# EasyEDA Pro project AmpBoard64SMD.eprj, board Mod16Top_1
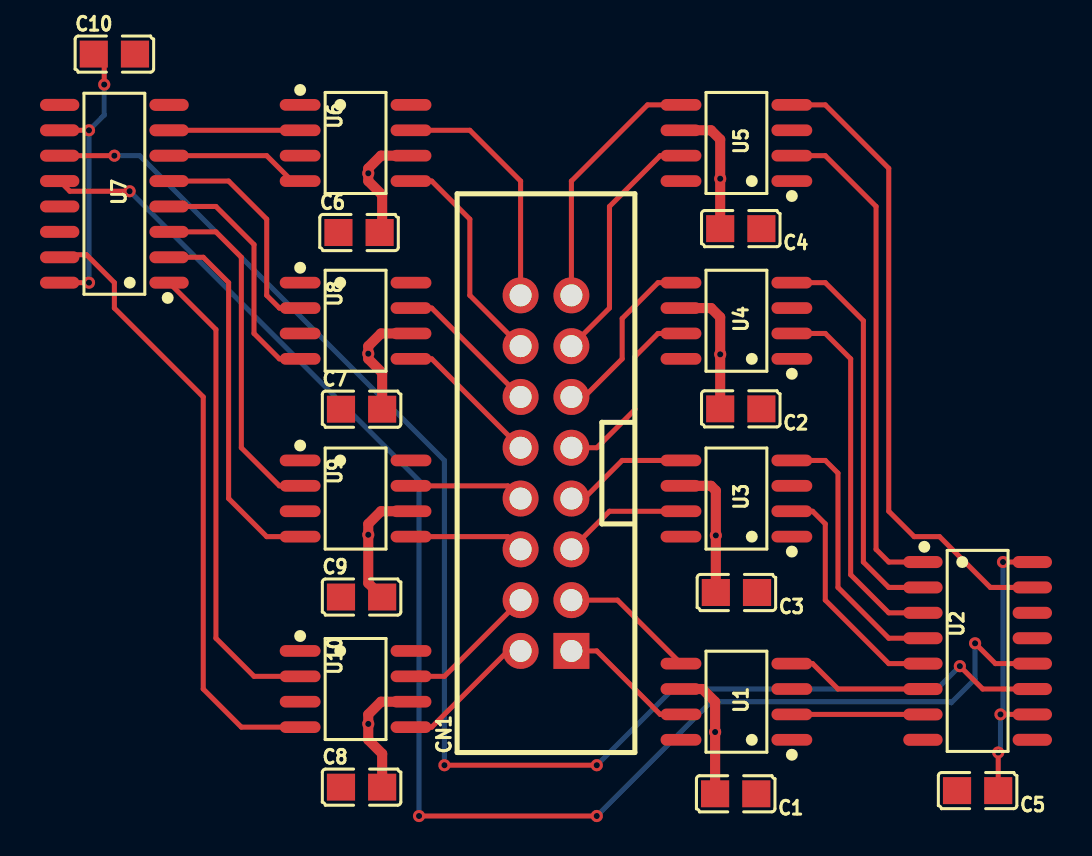
[diagram p7: board, top side]
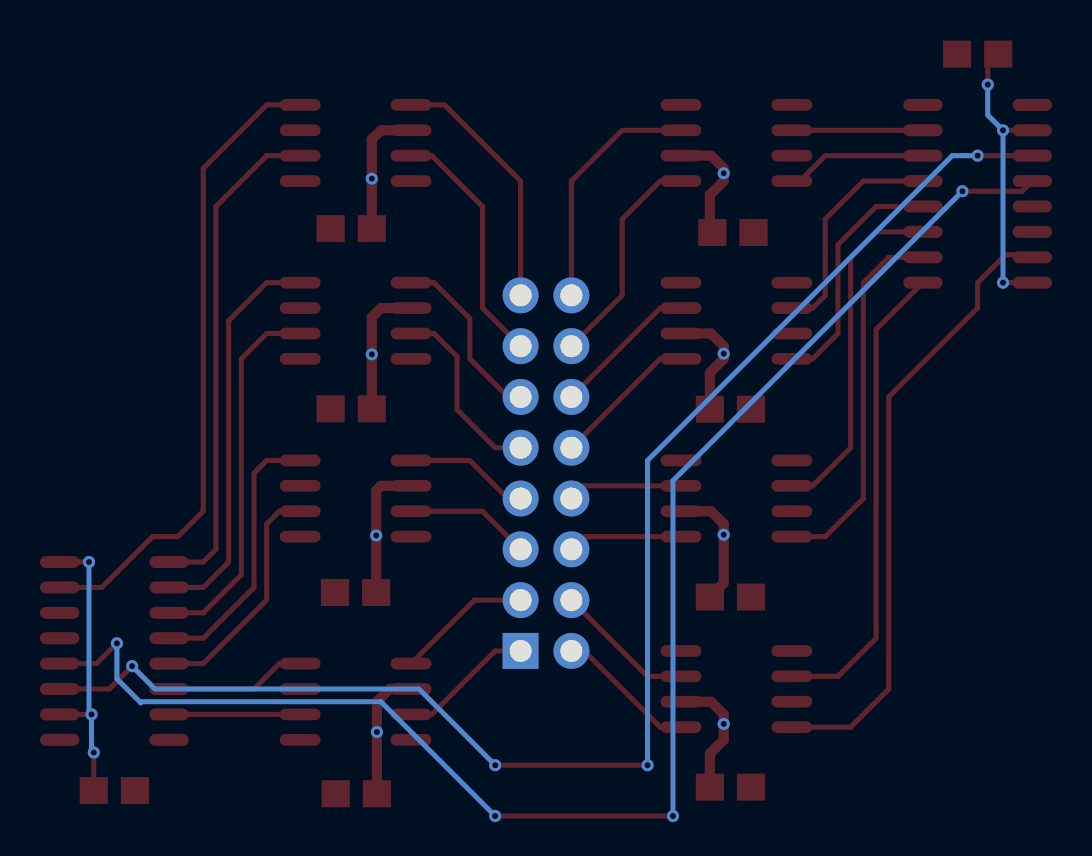
[diagram p8: board, bottom side, seen from below]

No outline. copper layers: Top Layer, Inner1, Inner2, Bottom Layer. Coordinates in mm from the lowest, leftmost part position.
Stack: Top Layer 0.035mm 外层铜厚1oz / Dielectric1 0.2104mm 7628 RC49% 8.6mil / Inner1 0.0152mm 内层铜厚 / Dielectric2 1.065mm 1.1mm H/HOZ 含铜 / Inner2 0.0152mm 内层铜厚 / Dielectric3 0.2104mm 7628 RC49% 8.6mil / Bottom Layer 0.035mm 外层铜厚1oz

## Design rules (mm)
template: JLCPCB Capability(Two Layers Board)
spacing copperThickness1oz (default): track to track 0.102, other pairs 0.152 to 0.3
spacing copperThickness2oz: track to track 0.203, other pairs 0.152 to 0.3
track width copperThickness1oz (default): min 0.127, default 0.254, max 2.54
track width copperThickness2oz: min 0.203, default 0.254, max 2.54
differential pair differentialPair (default): width min 0.127, default 0.254, max 2.54; gap min 0.152, default 0.152
via viaSize (default): diameter min 0.5, default 0.61, max 10; hole min 0.3, default 0.305, max 6.3

## Placement (name value [footprint] x y rotation side)
C1  100pF  [C0805]  31.08 0 180 top
C2  100pF  [C0805]  31.33 19.25 180 top
C3  100pF  [C0805]  31.12 10.07 180 top
C4  100pF  [C0805]  31.33 28.26 180 top
C5  100pF  [C0805]  43.18 0.16 180 top
C6  100pF  [C0805]  12.24 28.07 0 top
C7  100pF  [C0805]  12.37 19.23 0 top
C8  100pF  [C0805]  12.37 0.33 0 top
C9  100pF  [C0805]  12.37 9.84 0 top
C10  100pF  [C0805]  0 36.99 0 top
CN1  KH-2.54PH180-2X8P-L8.9  [CONN-TH_16P-P2.54_KINGHELM_KH-2.54PH180-2X8P-L8.9]  21.59 16.03 90 top
U1  IXDN602SIATR  [SOIC-8_L4.9-W3.9-P1.27-LS6.0-BL]  31.12 4.6 90 top
U2  74HC595D,118  [SOIC-16_L9.9-W3.9-P1.27-LS6.0-BL]  43.18 7.14 270 top
U3  IXDN602SIATR  [SOIC-8_L4.9-W3.9-P1.27-LS6.0-BL]  31.12 14.76 90 top
U4  IXDN602SIATR  [SOIC-8_L4.9-W3.9-P1.27-LS6.0-BL]  31.12 23.65 90 top
U5  IXDN602SIATR  [SOIC-8_L4.9-W3.9-P1.27-LS6.0-BL]  31.12 32.54 90 top
U6  IXDN602SIATR  [SOIC-8_L4.9-W3.9-P1.27-LS6.0-BL]  12.07 32.54 270 top
U7  74HC595D,118  [SOIC-16_L9.9-W3.9-P1.27-LS6.0-BL]  0 30 90 top
U8  IXDN602SIATR  [SOIC-8_L4.9-W3.9-P1.27-LS6.0-BL]  12.07 23.65 270 top
U9  IXDN602SIATR  [SOIC-8_L4.9-W3.9-P1.27-LS6.0-BL]  12.07 14.76 270 top
U10  IXDN602SIATR  [SOIC-8_L4.9-W3.9-P1.27-LS6.0-BL]  12.07 5.24 270 top

## Footprints (pads in the part's own frame, mm; a bottom-side part is the same pattern mirrored in y, then rotated)
C0805
  rect 1.41x1.35 smd: 1(-1.03,0) 2(1.03,0)
CONN-TH_16P-P2.54_KINGHELM_KH-2.54PH180-2X8P-L8.9
  rect 1.8x1.8 hole 1.1: 1(-8.89,-1.27)
  round 1.8 hole 1.1: 2(-8.89,1.27) 3(-6.35,-1.27) 4(-6.35,1.27) 5(-3.81,-1.27) 6(-3.81,1.27) 7(-1.27,-1.27) 8(-1.27,1.27) 9(1.27,-1.27) 10(1.27,1.27) 11(3.81,-1.27) 12(3.81,1.27) 13(6.35,-1.27) 14(6.35,1.27) 15(8.89,-1.27) 16(8.89,1.27)
SOIC-8_L4.9-W3.9-P1.27-LS6.0-BL
  oval 0.588x2.045 smd: 1(-1.905,-2.772) 2(-0.635,-2.772) 3(0.635,-2.772) 4(1.905,-2.772) 5(1.905,2.772) 6(0.635,2.772) 7(-0.635,2.772) 8(-1.905,2.772)
SOIC-16_L9.9-W3.9-P1.27-LS6.0-BL
  oval 0.602x1.971 smd: 1(-4.445,-2.736) 2(-3.175,-2.736) 3(-1.905,-2.736) 4(-0.635,-2.736) 5(0.635,-2.736) 6(1.905,-2.736) 7(3.175,-2.736) 8(4.445,-2.736) 9(4.445,2.736) 10(3.175,2.736) 11(1.905,2.736) 12(0.635,2.736) 13(-0.635,2.736) 14(-1.905,2.736) 15(-3.175,2.736) 16(-4.445,2.736)

## Nets
As in the schematic.

Pads without a net: U1 1 8; U2 9; U3 1 8; U4 1 8; U5 1 8; U6 1 8; U7 9; U8 1 8; U9 1 8; U10 1 8

## Via types
v1: diameter 0.61, hole 0.305, Top Layer to Bottom Layer, 22 vias

## Routing (per net, layer and track width the routed paths; a pad name or vN(x,y) marks a point on that pad's centre or on a via; arc(x,y) is an arc through that point)
+5V: length 29.5
  Top Layer w0.254: v1(-1.27,25.56) U7.16 ; v1(44.45,11.59) U2.16 ; C10.1 -0.51,36.47 v1(-0.51,35.47) ; v1(44.32,3.97) U2.10 ; C5.1 v1(44.21,2.06) ; v1(-1.27,33.18) U7.10
  Bottom Layer w0.254: v1(44.45,11.59) 44.45,4.1 v1(44.32,3.97) 44.32,2.18 v1(44.21,2.06) ; v1(-0.51,35.47) -0.51,33.94 v1(-1.27,33.18) v1(-1.27,25.56)
VCC: length 51.3
  Top Layer w0.508: U1.6 29.41,5.24 30.05,4.6 v1(30.05,3.09) C1.2 ; U3.6 29.84,15.4 30.09,15.16 v1(30.09,12.92) C3.2 ; C4.2 v1(30.3,30.76) 30.3,32.72 29.84,33.18 U5.6 ; U10.6 13.34,4.6 12.7,3.97 v1(12.7,3.49) 12.7,2.7 13.4,2 C8.2 ; C7.2 13.4,21.05 12.7,21.75 12.7,22.38 13.34,23.02 U8.6 ; U6.6 13.34,31.91 12.7,31.27 12.7,30.64 13.4,29.94 13.4,28.19 C6.2 ; C2.2 v1(30.3,21.97) 30.3,23.83 29.84,24.29 U4.6 ; C9.2 12.7,10.53 v1(12.7,12.95) 12.7,13.49 13.34,14.13 U9.6
  vias: v1(12.7,31.03) v1(12.7,22.01)
CLOCK: length 72.7
  Top Layer w0.254: U2.11 43.43,5.24 v1(42.29,6.38) ; v1(16.51,1.43) v1(24.13,1.43) ; U7.11 v1(0,31.91)
  Bottom Layer w0.254: v1(24.13,1.43) 27.94,5.24 41.15,5.24 v1(42.29,6.38) ; v1(0,31.91) 1.27,31.91 16.51,16.67 v1(16.51,1.43)
LATCH: length 76.7
  Top Layer w0.254: U7.12 -2.23,30.13 v1(0.76,30.13) ; U2.12 44.07,6.51 v1(43.05,7.53) ; v1(15.24,-1.11) v1(24.13,-1.11)
  Bottom Layer w0.254: v1(0.76,30.13) 15.24,15.65 v1(15.24,-1.11) ; v1(43.05,7.53) 43.05,5.75 41.86,4.55 41.81,4.6 29.84,4.6 v1(24.13,-1.11)
$1N942: length 6.8
  Top Layer w0.254: U1.7 27.31,3.97 24.13,7.14 CN1.1
$1N946: length 6.8
  Top Layer w0.254: CN1.3 25.17,9.68 U1.5
$1N951: length 6.3
  Top Layer w0.254: CN1.5 24.77,14.13 U3.7
$1N956: length 6.3
  Top Layer w0.254: CN1.7 23.5,14.76 25.4,16.67 U3.5
$1N961: length 9.4
  Top Layer w0.254: U4.7 27.19,23.02 26.04,21.86 26.04,19.21 24.13,17.3 CN1.9
$1N970: length 9
  Top Layer w0.254: CN1.11 23.5,19.84 25.4,21.75 25.4,23.77 27.19,25.56 U4.5
$1N975: length 12.4
  Top Layer w0.254: U5.7 27.31,31.91 24.77,29.37 24.77,24.29 CN1.13
$1N980: length 12.8
  Top Layer w0.254: U5.5 26.67,34.45 22.86,30.64 CN1.15
$1N1841: length 12.2
  Top Layer w0.254: 20.32,24.92 20.32,30.64 17.78,33.18 U6.7
$1N1844: length 11.1
  Top Layer w0.254: 20.32,22.38 17.78,24.92 17.78,28.73 15.88,30.64 U6.5
$1N1848: length 7.3
  Top Layer w0.254: U8.7 15.88,24.29 20.32,19.84
$1N1852: length 7.3
  Top Layer w0.254: 20.32,17.3 15.88,21.75 U8.5
$1N1856: length 5.7
  Top Layer w0.254: U9.7 19.69,15.4 20.32,14.76
$1N1860: length 5.7
  Top Layer w0.254: U9.5 19.69,12.86 20.32,12.22
$1N1864: length 7.1
  Top Layer w0.254: 20.32,9.68 16.51,5.87 U10.7
$1N1868: length 7.1
  Top Layer w0.254: U10.5 15.88,3.33 19.69,7.14 20.32,7.14
$1N3344: length 32.1
  Top Layer w0.254: U5.4 35.56,34.45 38.74,31.27 38.74,14.13 40.01,12.86 41.28,12.86 43.82,10.32 U2.15
$1N3349: length 25
  Top Layer w0.254: U5.2 35.56,31.91 38.1,29.37 38.1,12.22 38.74,11.59 U2.1
$1N3353: length 19.9
  Top Layer w0.254: U2.2 38.74,10.32 37.47,11.59 37.47,23.65 35.56,25.56 U4.4
$1N3358: length 18.7
  Top Layer w0.254: U2.3 38.74,9.05 36.83,10.95 36.83,21.75 35.56,23.02 U4.2
$1N3363: length 13.6
  Top Layer w0.254: U3.4 35.56,16.67 36.2,16.03 36.2,10.32 38.74,7.78 40.44,7.78
$1N3368: length 11.9
  Top Layer w0.254: U2.5 38.74,6.51 35.56,9.68 35.56,13.49 34.93,14.13 U3.2
$1N3373: length 7.1
  Top Layer w0.254: U2.6 36.2,5.24 34.93,6.51 U1.4
$1N3378: length 6.6
  Top Layer w0.254: U1.2 U2.7
$1N3403: length 31.2
  Top Layer w0.254: U7.15 -2.61,26.96 -1.4,26.96 0,25.56 0,24.29 4.45,19.84 4.45,5.24 6.35,3.33 U10.4
$1N3408: length 23.8
  Top Layer w0.254: U7.1 5.08,23.21 5.08,7.78 6.99,5.87 U10.2
$1N3412: length 18.7
  Top Layer w0.254: U9.4 7.62,12.86 5.72,14.76 5.72,25.56 4.45,26.83 U7.2
$1N3424: length 17.4
  Top Layer w0.254: U9.2 8.26,15.4 6.35,17.3 6.35,26.83 5.08,28.1 U7.3
$1N3429: length 12.3
  Top Layer w0.254: U8.4 8.26,21.75 6.99,23.02 6.99,27.46 5.08,29.37 2.74,29.37
$1N3434: length 11.4
  Top Layer w0.254: U7.5 5.72,30.64 7.62,28.73 7.62,24.92 8.26,24.29 U8.2
$1N3439: length 7.1
  Top Layer w0.254: U6.4 8.89,30.64 7.62,31.91 U7.6
$1N3444: length 6.6
  Top Layer w0.254: U7.7 U6.2
